# Altium schematic sheet Main Schematics.SchDoc (part 2 of 3)
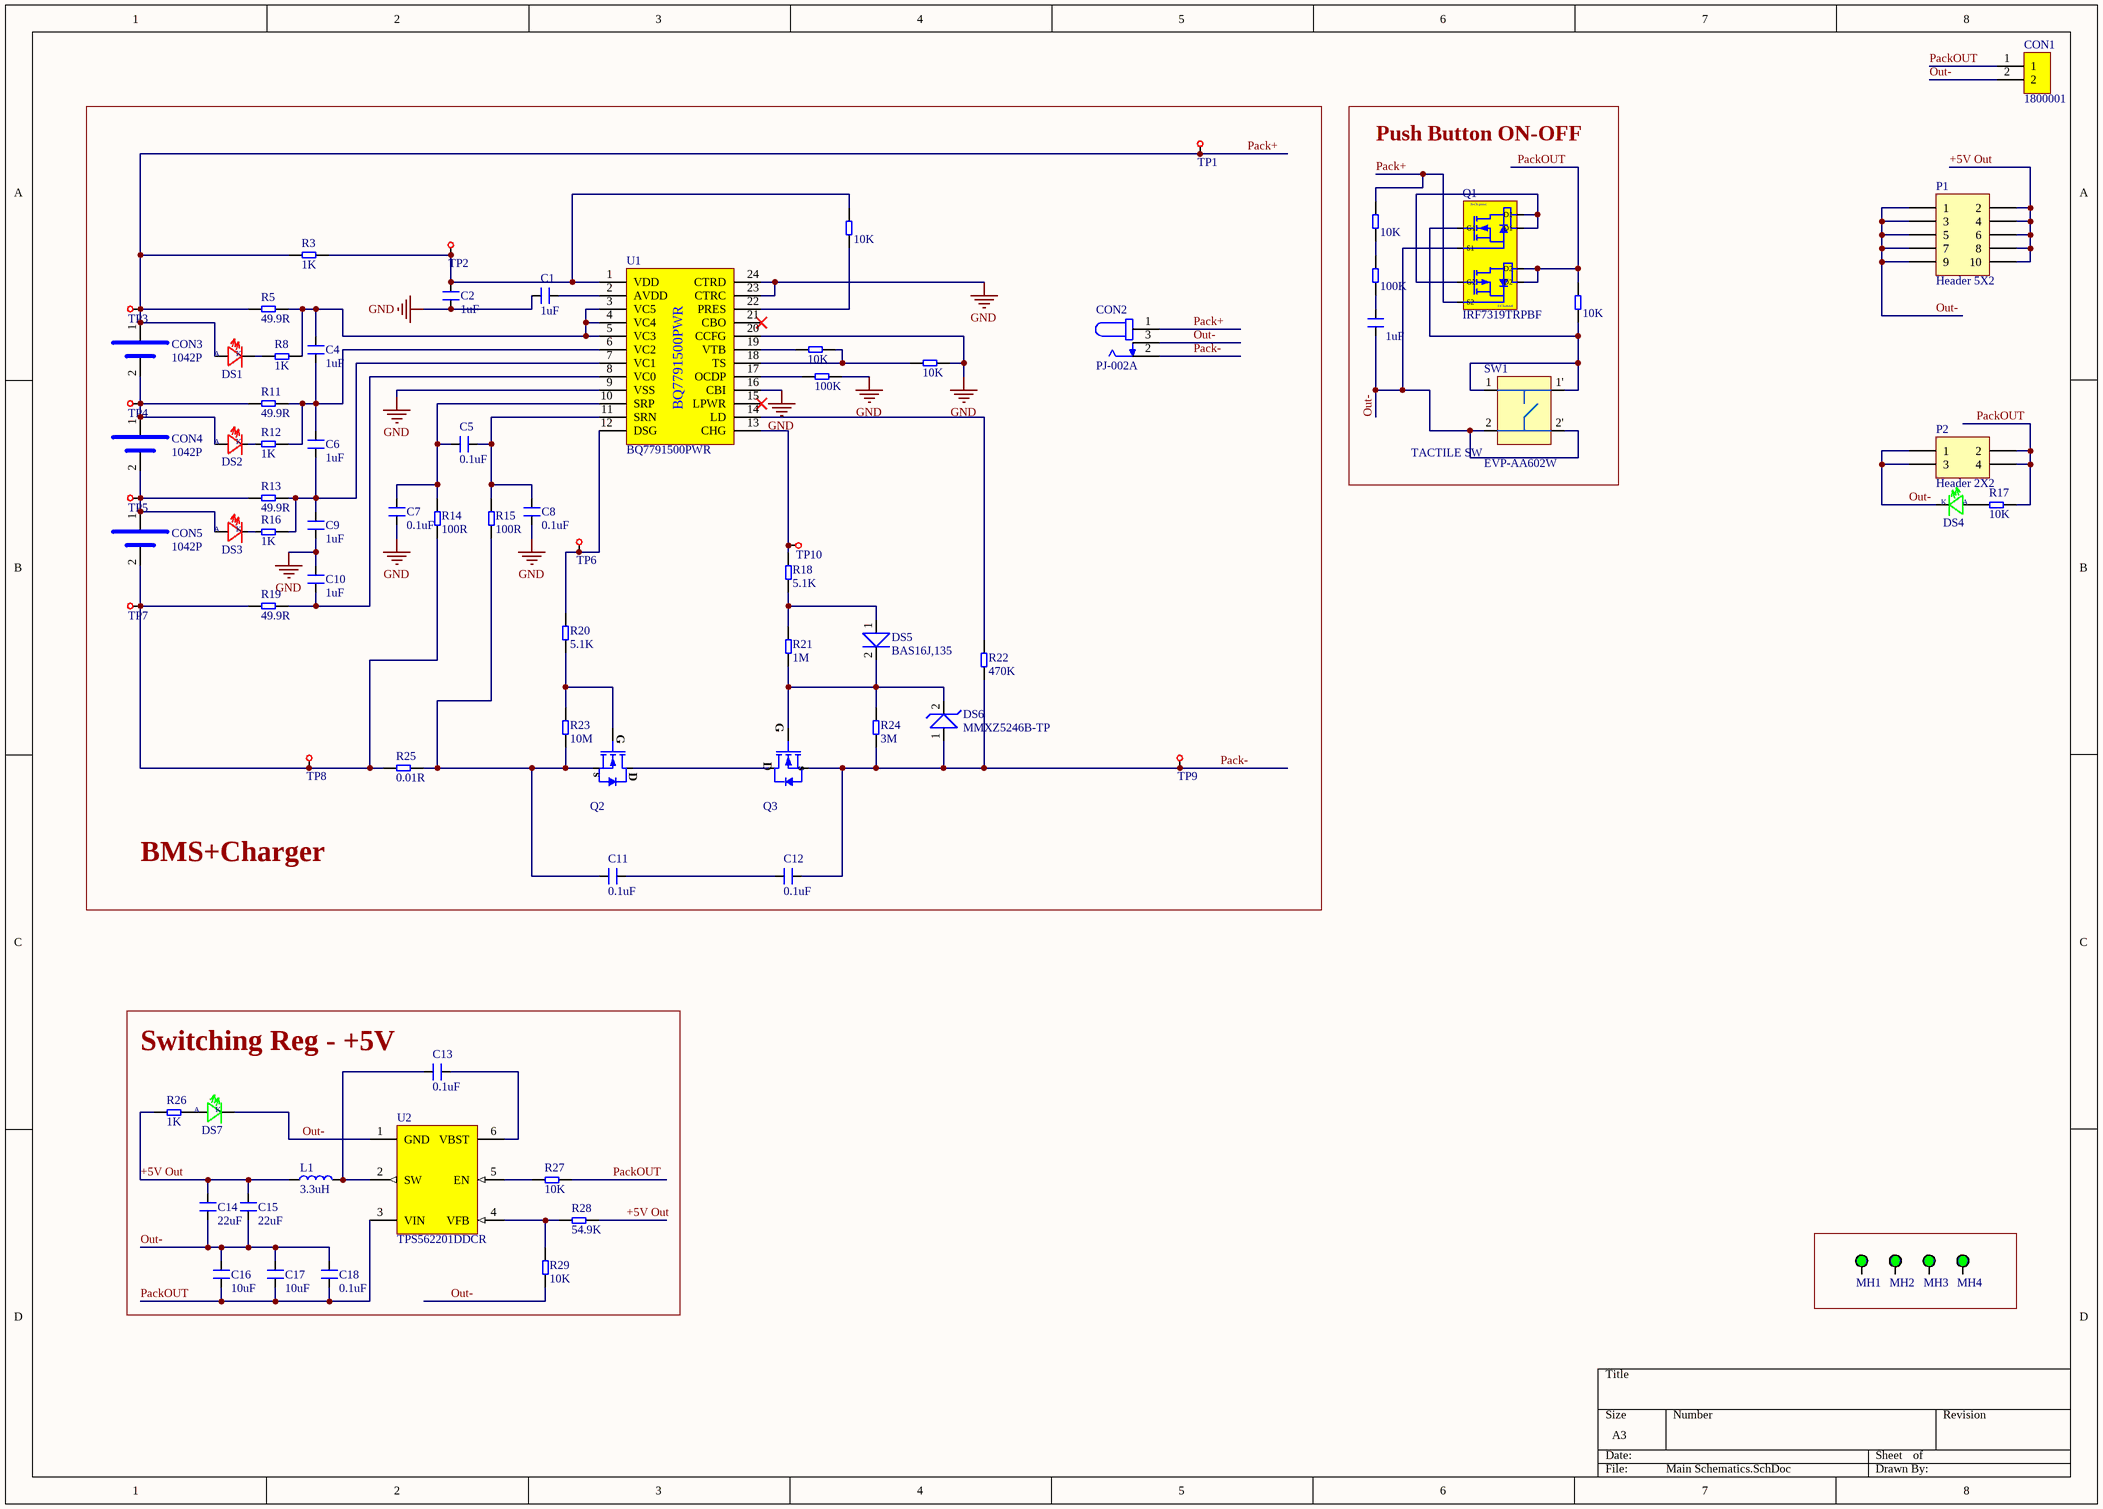
[diagram p1: Main Schematics.SchDoc]
## Library data of the parts
C1 C2 C4 C6 C9 C10 = CAP_1uF_16V_20%_0805: Cap, 1UF, 16V, Mlcc, 0805;; Manufacturer: KEMET; Manufacturer Part Number: C0805C105Z4VAC7210; Tolerance: 80%; Supplier 1: Mouser; RoHS: Yes; Category: Ceramic Capacitors; Stock 1: 28110; Pricing 1: 1=0.12, 10=0.079, 50=0.079, 100=0.037, 1000=0.022, 10000=0.017 (USD); Mount: Surface Mount; Case/Package: 0805; Min Operating Temperature: -30°C; Max Operating Temperature: 85°C; Series: SMD Comm Y5V; Voltage Rating: 16V; Capacitance: 1uF; RoHS Compliant: Yes; Supplier 2: Digi-Key; Manufacturer 2: KEMET; Manufacturer Part Number 2: C0805C105Z4VAC7210; Stock 2: 109336; Pricing 2: 1=0.1, 10=0.075, 50=0.0424, 100=0.0351, 500=0.0246, 1000=0.02036, 2500=0.01895, 5000=0.01734 (USD); Supplier 3: Mouser; Manufacturer 3: KEMET; Manufacturer Part Number 3: C0805C105Z4VAC7210; Stock 3: 14106; Pricing 3: 1=0.12, 10=0.079, 50=0.079, 100=0.037, 1000=0.022, 10000=0.016 (USD)
C3 = CAP_1uF_50V_10%_0805: Multilayer Ceramic Capacitor, 1 uF, 50 V, ± 10%, X7R, 0805 [2012 Metric]; Manufacturer: KEMET; Manufacturer Part Number: C0805C105K5RACTU; Voltage Rating: 50V; Supplier 1: Mouser; RoHS: Yes; Category: Ceramic Capacitors; Stock 1: 246479; Pricing 1: 1=0.33, 10=0.171, 50=0.171, 100=0.11, 1000=0.092, 10000=0.076 (USD); Mount: Surface Mount,PCB; Case/Package: 0805; Case Code (Metric): 2012; Case Code (Imperial): 0805; Dielectric Material: Ceramic; Min Operating Temperature: -55°C; Max Operating Temperature: 125°C; Packaging: Tape and Reel; Capacitance: 1uF; Tolerance: 10%; Voltage Rating (DC): 50V; Package Quantity: 1; Dielectric: X7R; Termination: SMD/SMT; Voltage: 50V; Series: C; Construction: Flat; Length: 2mm; Width: 0.049inch; Height: 1.25mm; Thickness: 0.055inch; Depth: 1.25mm; Reach SVHC Compliant: No; RoHS Compliant: Yes; ComponentLink1URL: https://datasheet.ciiva.com/7842/1732744-7842192.pdf?src-supplier=Element14; ComponentLink1Description: https://datasheet.ciiva.com/7842/1732744-7842192.pdf?src-supplier=Element14; ComponentLink2URL: https://datasheet.ciiva.com/22700/1851736-22700523.pdf?src-supplier=Element14; ComponentLink2Description: https://datasheet.ciiva.com/22700/1851736-22700523.pdf?src-supplier=Element14; ComponentLink3URL: https://datasheet.ciiva.com/5408/kem-c1002-x7r-smd-5408569.pdf?src-supplier=Mouser; ComponentLink3Description: https://datasheet.ciiva.com/5408/kem-c1002-x7r-smd-5408569.pdf?src-supplier=Mouser; Supplier 2: Digi-Key; Manufacturer 2: KEMET; Manufacturer Part Number 2: C0805C105K5RACTU; Stock 2: 167514; Pricing 2: 1=0.33, 10=0.231, 50=0.162, 100=0.1388, 500=0.10412, 1000=0.08792 (USD)
C5 C7 C8 C11 C12 = CAP_0.1uF_16V_10%_0805: Multilayer Ceramic Capacitor, 0.1 uF, 16 V, ± 10%, X7R, 0805 [2012 Metric]; Manufacturer: KEMET; Manufacturer Part Number: C0805C104K4RACTU; Capacitance: 100nF; Voltage Rating: 16V; Supplier 1: Mouser; RoHS: Yes; Category: Ceramic Capacitors; Stock 1: 90803; Pricing 1: 1=0.15, 10=0.078, 50=0.078, 100=0.044, 1000=0.03, 10000=0.023 (USD); Mount: Surface Mount,PCB; Case/Package: 0805; Number of Pins: 2; Case Code (Imperial): 0805; Case Code (Metric): 2012; Contact Plating: Tin,Matte; Dielectric Material: Ceramic; Min Operating Temperature: -55°C; Max Operating Temperature: 125°C; Packaging: Tape and Reel; Package Quantity: 4000; Tolerance: 10%; Voltage Rating (DC): 16V; Dielectric: X7R; Termination: SMD/SMT; Voltage: 16V; Series: SMD Comm X7R; Construction: Flat; Length: 2mm; Height: 0.9mm; Lead Pitch: 0.75mm; Depth: 1.25mm; Radiation Hardening: No; Reach SVHC Compliant: No; RoHS Compliant: Yes; ComponentLink1URL: https://datasheet.ciiva.com/46443/1851736-46443711.pdf?src-supplier=Element14; ComponentLink1Description: https://datasheet.ciiva.com/46443/1851736-46443711.pdf?src-supplier=Element14; ComponentLink2URL: https://datasheet.ciiva.com/46443/1851736-46443710.pdf?src-supplier=Element14; ComponentLink2Description: https://datasheet.ciiva.com/46443/1851736-46443710.pdf?src-supplier=Element14; Supplier 2: Digi-Key; Manufacturer 2: KEMET; Manufacturer Part Number 2: C0805C104K4RACTU; Stock 2: 179111; Pricing 2: 1=0.18, 10=0.13, 50=0.0736, 100=0.061, 500=0.04274, 1000=0.03539 (USD); Supplier 3: Mouser; Manufacturer 3: KEMET; Manufacturer Part Number 3: C0805C104K4RACTU; Stock 3: 60653; Pricing 3: 1=0.17, 10=0.078, 50=0.078, 100=0.045, 1000=0.032, 10000=0.023 (USD); Supplier Part Number 3: 80-C0805C104K4R
C13 C18 = CAP_0.1uF_50V_10%_0805: SMD Comm X7R 0805 (2012Metric) Ceramic Capacitor 0.079Lx0.049W 2.00mmx1.25mm X7R ±10% 0.1muF; Manufacturer: KEMET; Manufacturer Part Number: C0805C104K5RAC7210; Capacitance: 100nF; Voltage Rating: 50V; Supplier 1: Mouser; RoHS: Yes; Category: Ceramic Capacitors; Stock 1: 173866; Pricing 1: 1=0.13, 10=0.055, 50=0.055, 100=0.032, 1000=0.024, 10000=0.024 (USD); Mount: Surface Mount; Case/Package: 0805; Case Code (Metric): 2012; Case Code (Imperial): 0805; Dielectric Material: Ceramic; Min Operating Temperature: -55°C; Max Operating Temperature: 125°C; Tolerance: 10%; Dielectric: X7R; Packaging: Tape and Reel; Package Quantity: 15000; Voltage Rating (DC): 50V; Termination: SMD/SMT; Series: C; Construction: Flat; Length: 2mm; Width: 0.049inch; Height: 0.9mm; Depth: 1.25mm; Lead Pitch: 0.75mm; Thickness: 0.035inch; Radiation Hardening: No; RoHS Compliant: Yes; ComponentLink1URL: http://www.farnell.com/datasheets/2750461.pdf?src-supplier=Farnell; ComponentLink1Description: http://www.farnell.com/datasheets/2750461.pdf?src-supplier=Farnell; ComponentLink2URL: http://www.mouser.com/ds/2/212/KEM_C1002_X7R_SMD-1102033.pdf?src-supplier=Mouser; ComponentLink2Description: http://www.mouser.com/ds/2/212/KEM_C1002_X7R_SMD-1102033.pdf?src-supplier=Mouser; ComponentLink3URL: http://components.arrow.com/part/dataview/1379060S8109168N7429?src-supplier=Arrow+Electronics; ComponentLink3Description: http://components.arrow.com/part/dataview/1379060S8109168N7429?src-supplier=Arrow+Electronics; ComponentLink4URL: http://capacitoredge.kemet.com/capedge2/DataSheet/Datasheet-C0805C104K5RAC7210.pdf?pn=C0805C104K5RAC7210&src-supplier=Avnet; ComponentLink4Description: http://capacitoredge.kemet.com/capedge2/DataSheet/Datasheet-C0805C104K5RAC7210.pdf?pn=C0805C104K5RAC7210&src-supplier=Avnet; ComponentLink5URL: http://www.farnell.com/datasheets/2750461.pdf?src-supplier=Newark; ComponentLink5Description: http://www.farnell.com/datasheets/2750461.pdf?src-supplier=Newark; ComponentLink6URL: http://www.farnell.com/datasheets/2750461.pdf?src-supplier=Element14; ComponentLink6Description: http://www.farnell.com/datasheets/2750461.pdf?src-supplier=Element14; ComponentLink7URL: https://api.kemet.com/component-edge/download/datasheet/C0805C104K5RAC7210.pdf?src-supplier=Digi-Key; ComponentLink7Description: https://api.kemet.com/component-edge/download/datasheet/C0805C104K5RAC7210.pdf?src-supplier=Digi-Key; ComponentLink8URL: https://www.verical.com/server-webapp/html/getDatasheet?partID=114317&src-supplier=Verical; ComponentLink8Description: https://www.verical.com/server-webapp/html/getDatasheet?partID=114317&src-supplier=Verical; ComponentLink9URL: http://www.kemet.com/kemet/web/homepage/kechome.nsf/weben/C4DA2DA1D1C9D3C3CA2570A50016092D/$file/KEM_C1002_X7R_SMD.pdf; ComponentLink9Description: http://www.kemet.com/kemet/web/homepage/kechome.nsf/weben/C4DA2DA1D1C9D3C3CA2570A50016092D/$file/KEM_C1002_X7R_SMD.pdf; ComponentLink10URL: https://datasheet.octopart.com/C0805C104K5RAC7210-KEMET-datasheet-130259742.pdf?src-supplier=TME; ComponentLink10Description: https://datasheet.octopart.com/C0805C104K5RAC7210-KEMET-datasheet-130259742.pdf?src-supplier=TME; ComponentLink11URL: https://datasheet.octopart.com/C0805C104K5RAC7210-KEMET-datasheet-37550250.pdf?src-supplier=Electro+Sonic; ComponentLink11Description: https://datasheet.octopart.com/C0805C104K5RAC7210-KEMET-datasheet-37550250.pdf?src-supplier=Electro+Sonic; Supplier 2: Digi-Key; Manufacturer 2: KEMET; Manufacturer Part Number 2: C0805C104K5RAC7210; Stock 2: 1684433; Pricing 2: 1=0.13, 10=0.092, 50=0.052, 100=0.0431, 500=0.03022, 1000=0.02502, 2500=0.02328, 5000=0.0213 (USD); Supplier 3: Mouser; Manufacturer 3: KEMET; Manufacturer Part Number 3: C0805C104K5RAC7210; Stock 3: 170881; Pricing 3: 1=0.13, 10=0.055, 50=0.055, 100=0.032, 1000=0.024, 10000=0.018 (USD); Supplier Part Number 3: 80-C0805C104K5R7210
C14 C15 = CAP_22uF-25V-20%-0805: 0805 25 V 22 uF ±20% Tolerance X5R Monolithic Ceramic Chip Capacitor; Manufacturer: Murata Electronics; Manufacturer Part Number: GRM21BR61E226ME44K; Manufacturer 1: Murata; Voltage Rating: 25V; Case/Package: 0805; Supplier-1: Digikey; Supplier 1: Digi-Key; Manufacturer Part Number 1: GRM21BR61E226ME44K; RoHS: Yes; Category: Ceramic Capacitors; Stock 1: 809289; Pricing 1: 1=0.3, 10=0.205, 50=0.1436, 100=0.1231, 500=0.09234, 1000=0.07798, 2500=0.07387, 5000=0.06977 (USD); Mount: Surface Mount; Case Code (Imperial): 0805; Case Code (Metric): 2012; Weight: 0.000335oz; Min Operating Temperature: -55°C; Max Operating Temperature: 85°C; Packaging: Tape and Reel; Capacitance: 22uF; Tolerance: 20%; Dielectric: X5R; Termination: SMD/SMT; Voltage Rating (DC): 25V; Package Quantity: 10000; Series: GRM; Length: 0.079inch; Width: 1.25mm; Height: 1.25mm; Thickness: 0.057inch; RoHS Compliant: Yes; ComponentLink1URL: http://www.mouser.com/ds/2/281/c02e-2905.pdf?src-supplier=Mouser; ComponentLink1Description: http://www.mouser.com/ds/2/281/c02e-2905.pdf?src-supplier=Mouser; ComponentLink2URL: http://search.murata.co.jp/Ceramy/image/img/A01X/G101/ENG/GRM21BR61E226ME44-01.pdf?src-supplier=Digi-Key; ComponentLink2Description: http://search.murata.co.jp/Ceramy/image/img/A01X/G101/ENG/GRM21BR61E226ME44-01.pdf?src-supplier=Digi-Key; ComponentLink3URL: https://search.murata.co.jp/Ceramy/image/img/A01X/G101/ENG/GRM21BR61E226ME44-01.pdf?src-supplier=Digi-Key; ComponentLink3Description: https://search.murata.co.jp/Ceramy/image/img/A01X/G101/ENG/GRM21BR61E226ME44-01.pdf?src-supplier=Digi-Key; Supplier Part Number 1: 490-14661-1-ND
C16 C17 = CAP_10uF_25V_10%_1206: Multilayer Ceramic Capacitor, 10 uF, 25 V, ± 10%, X5R, 1206 [3216 Metric]; Manufacturer 1: KEMET; Manufacturer Part Number 1: C1206C106K3PACTU; Material: 4241ConductorMaterial; Voltage Rating (DC): 25V; Dissipation Factor: 5%; Supplier 1: Digi-Key; RoHS: Yes; Category: Ceramic Capacitors; Stock 1: 101746; Pricing 1: 1=0.35, 10=0.243, 50=0.17, 100=0.1457, 500=0.1093, 1000=0.09229 (USD); Mount: Surface Mount; Case/Package: 1206; Number of Pins: 2NUMBER; Case Code (Imperial): 1206; Case Code (Metric): 3216; Contact Plating: 154ConductorMaterial; Min Operating Temperature: -55°C; Max Operating Temperature: 85°C; Capacitance: 10uF; Tolerance: 10%; Dielectric: X5R; Packaging: Tape and Reel; Voltage Rating: 25V; Series: SMD Comm X5R; Voltage Rating (AC): 25V; Length: 3.2mm; Width: 1.6002mm; Thickness: 1.8034mm; Depth: 1.6mm; Radiation Hardening: No; Reach SVHC Compliant: 4186SVHC; Lead Free: 5697LeadFree; RoHS Compliant: Yes; ComponentLink1URL: http://www.farnell.com/datasheets/2739687.pdf?src-supplier=Farnell; ComponentLink1Description: http://www.farnell.com/datasheets/2739687.pdf?src-supplier=Farnell; ComponentLink2URL: https://www.verical.com/server-webapp/html/getDatasheet?partID=385834&src-supplier=Verical; ComponentLink2Description: https://www.verical.com/server-webapp/html/getDatasheet?partID=385834&src-supplier=Verical; ComponentLink3URL: http://www.onlinecomponents.com/productFiles/mf-KEM/kem_c1006_x5r_smd.pdf?src-supplier=Onlinecomponents.com; ComponentLink3Description: http://www.onlinecomponents.com/productFiles/mf-KEM/kem_c1006_x5r_smd.pdf?src-supplier=Onlinecomponents.com; ComponentLink4URL: http://datasheet.octopart.com/C1206C106K3PAC-TU-Kemet-datasheet-5314969.pdf?src-supplier=Onlinecomponents.com; ComponentLink4Description: http://datasheet.octopart.com/C1206C106K3PAC-TU-Kemet-datasheet-5314969.pdf?src-supplier=Onlinecomponents.com; ComponentLink5URL: http://www.farnell.com/datasheets/2739687.pdf?src-supplier=Newark; ComponentLink5Description: http://www.farnell.com/datasheets/2739687.pdf?src-supplier=Newark; ComponentLink6URL: https://api.kemet.com/component-edge/download/datasheet/C1206C106K3PACTU.pdf?src-supplier=Digi-Key; ComponentLink6Description: https://api.kemet.com/component-edge/download/datasheet/C1206C106K3PACTU.pdf?src-supplier=Digi-Key; ComponentLink7URL: http://datasheet.octopart.com/C1206C106K3PAC-TU-Kemet-datasheet-5314969.pdf?src-supplier=Mouser; ComponentLink7Description: http://datasheet.octopart.com/C1206C106K3PAC-TU-Kemet-datasheet-5314969.pdf?src-supplier=Mouser; ComponentLink8URL: http://datasheet.octopart.com/C1206C106K3PAC-TU-Kemet-datasheet-5314969.pdf?src-supplier=Digi-Key; ComponentLink8Description: http://datasheet.octopart.com/C1206C106K3PAC-TU-Kemet-datasheet-5314969.pdf?src-supplier=Digi-Key; ComponentLink9URL: http://datasheet.octopart.com/C1206C106K3PAC-TU-Kemet-datasheet-5314969.pdf?src-supplier=Verical; ComponentLink9Description: http://datasheet.octopart.com/C1206C106K3PAC-TU-Kemet-datasheet-5314969.pdf?src-supplier=Verical; ComponentLink10URL: http://datasheet.octopart.com/C1206C106K3PAC-TU-Kemet-datasheet-5314969.pdf?src-supplier=Avnet; ComponentLink10Description: http://datasheet.octopart.com/C1206C106K3PAC-TU-Kemet-datasheet-5314969.pdf?src-supplier=Avnet; ComponentLink11URL: https://datasheet.octopart.com/C1206C106K3PACTU-Kemet-datasheet-10978831.pdf?src-supplier=Newark; ComponentLink11Description: https://datasheet.octopart.com/C1206C106K3PACTU-Kemet-datasheet-10978831.pdf?src-supplier=Newark; ComponentLink12URL: http://datasheet.octopart.com/C1206C106K3PAC-TU-Kemet-datasheet-5314969.pdf?src-supplier=Distrelec; ComponentLink12Description: http://datasheet.octopart.com/C1206C106K3PAC-TU-Kemet-datasheet-5314969.pdf?src-supplier=Distrelec; ComponentLink13URL: http://www.farnell.com/datasheets/2739687.pdf?src-supplier=Element14; ComponentLink13Description: http://www.farnell.com/datasheets/2739687.pdf?src-supplier=Element14; ComponentLink14URL: https://datasheet.octopart.com/C1206C106K3PACTU-Kemet-datasheet-22084244.pdf?src-supplier=Element14; ComponentLink14Description: https://datasheet.octopart.com/C1206C106K3PACTU-Kemet-datasheet-22084244.pdf?src-supplier=Element14; ComponentLink15URL: http://datasheet.octopart.com/C1206C106K3PAC-TU-Kemet-datasheet-5314969.pdf?src-supplier=Rs; ComponentLink15Description: http://datasheet.octopart.com/C1206C106K3PAC-TU-Kemet-datasheet-5314969.pdf?src-supplier=Rs; ComponentLink16URL: http://datasheet.octopart.com/C1206C106K3PAC-TU-Kemet-datasheet-5314969.pdf?src-supplier=LCSC; ComponentLink16Description: http://datasheet.octopart.com/C1206C106K3PAC-TU-Kemet-datasheet-5314969.pdf?src-supplier=LCSC; ComponentLink17URL: https://datasheet.octopart.com/C1206C106K3PAC7800-KEMET-datasheet-165611373.pdf?src-supplier=TME; ComponentLink17Description: https://datasheet.octopart.com/C1206C106K3PAC7800-KEMET-datasheet-165611373.pdf?src-supplier=TME; ComponentLink18URL: http://datasheet.octopart.com/C1206C106K3PAC-TU-Kemet-datasheet-5314969.pdf?src-supplier=NAC+Semi; ComponentLink18Description: http://datasheet.octopart.com/C1206C106K3PAC-TU-Kemet-datasheet-5314969.pdf?src-supplier=NAC+Semi; ComponentLink19URL: http://datasheet.octopart.com/C1206C106K3PAC-TU-Kemet-datasheet-5314969.pdf?src-supplier=Quest; ComponentLink19Description: http://datasheet.octopart.com/C1206C106K3PAC-TU-Kemet-datasheet-5314969.pdf?src-supplier=Quest; ComponentLink20URL: http://datasheet.octopart.com/C1206C106K3PAC-TU-Kemet-datasheet-5314969.pdf?src-supplier=TTI; ComponentLink20Description: http://datasheet.octopart.com/C1206C106K3PAC-TU-Kemet-datasheet-5314969.pdf?src-supplier=TTI; ComponentLink21URL: https://datasheet.octopart.com/C1206C106K3PACTU-KEMET-datasheet-134136060.pdf?src-supplier=Electro+Sonic; ComponentLink21Description: https://datasheet.octopart.com/C1206C106K3PACTU-KEMET-datasheet-134136060.pdf?src-supplier=Electro+Sonic; Supplier Part Number 1: 399-C1206C106K3PAC7800DKR-ND
CON1 = CON_ED_2-pos_2.54mm_Phoenix Contact: PCB Terminal Screw 2.54mm 20AWG 160V 6A 2 Position Combicon Control Series; Supplier 1: Digi-Key; Manufacturer 1: Phoenix Contact; Manufacturer Part Number 1: 1800001; RoHS: Yes; Category: Terminal Blocks; Stock 1: 169; Pricing 1: 1=1.45, 10=1.408, 50=1.3156, 100=1.2104, 250=1.11828, 500=1.1154 (USD); ComponentLink1URL: http://www.mouser.com/ds/2/324/ItemDetail_1800001-929782.pdf?src-supplier=Mouser; ComponentLink1Description: http://www.mouser.com/ds/2/324/ItemDetail_1800001-929782.pdf?src-supplier=Mouser; ComponentLink2URL: http://components.arrow.com/part/dataview/46117015S71155N1555?src-supplier=Arrow+Electronics; ComponentLink2Description: http://components.arrow.com/part/dataview/46117015S71155N1555?src-supplier=Arrow+Electronics; ComponentLink3URL: https://media.digikey.com/pdf/Data%20Sheets/Phoenix%20Contact%20PDFs/1800001.pdf?src-supplier=Digi-Key; ComponentLink3Description: https://media.digikey.com/pdf/Data%20Sheets/Phoenix%20Contact%20PDFs/1800001.pdf?src-supplier=Digi-Key; Supplier Part Number 1: 277-17216-ND
CON2 = CON_ED_DC-JACK_RA_PJ-002A: 2.0 x 6.5 mm, 2.5 A, Horizontal, Through Hole, Dc Power Jack Connector; Manufacturer 1: CUI Devices; Supplier 1: Digi-Key; Manufacturer Part Number 1: PJ-002A; RoHS: Yes; Category: Power Connectors; Stock 1: 67885; Pricing 1: 1=0.7, 25=0.5692, 100=0.5037, 500=0.43708, 2500=0.33482, 10000=0.31654 (USD); ComponentLink1URL: https://datasheet.octopart.com/PJ-002A-CUI-datasheet-37357.pdf?src-supplier=Digi-Key; ComponentLink1Description: https://datasheet.octopart.com/PJ-002A-CUI-datasheet-37357.pdf?src-supplier=Digi-Key; ComponentLink2URL: https://datasheet.octopart.com/PJ-002A-CUI-Devices-datasheet-137760667.pdf?src-supplier=Future+Electronics; ComponentLink2Description: https://datasheet.octopart.com/PJ-002A-CUI-Devices-datasheet-137760667.pdf?src-supplier=Future+Electronics; ComponentLink3URL: https://datasheet.octopart.com/PJ-002A-CUI-Devices-datasheet-103108261.pdf?src-supplier=Electro+Sonic; ComponentLink3Description: https://datasheet.octopart.com/PJ-002A-CUI-Devices-datasheet-103108261.pdf?src-supplier=Electro+Sonic; ComponentLink4URL: https://datasheet.octopart.com/PJ-002A-CUI-Devices-datasheet-141000101.pdf?src-supplier=Master+Electronics; ComponentLink4Description: https://datasheet.octopart.com/PJ-002A-CUI-Devices-datasheet-141000101.pdf?src-supplier=Master+Electronics; Supplier Part Number 1: CP-002A-ND
CON3-CON5 = CON_18650_BATT: Cylindrical Battery Contacts, Clips, Holders & Springs SMT Polarized Holder for 18650 Battery; Manufacturer 1: Keystone Electronics; Supplier 1: Digi-Key; Manufacturer Part Number 1: 1042P; RoHS: No; Category: Batteries and Accessories; Stock 1: 25811; Pricing 1: 1=5.34, 25=4.4896, 100=3.7118, 250=3.41128, 500=3.19918, 1000=2.98708, 2500=2.70428, 5000=2.1 (USD); ComponentLink1URL: http://www.farnell.com/datasheets/2067690.pdf?src-supplier=Farnell; ComponentLink1Description: http://www.farnell.com/datasheets/2067690.pdf?src-supplier=Farnell; ComponentLink2URL: http://www.mouser.com/ds/2/215/042P-744096.pdf?src-supplier=Mouser; ComponentLink2Description: http://www.mouser.com/ds/2/215/042P-744096.pdf?src-supplier=Mouser; ComponentLink3URL: http://www.farnell.com/datasheets/2067690.pdf?src-supplier=Newark; ComponentLink3Description: http://www.farnell.com/datasheets/2067690.pdf?src-supplier=Newark; ComponentLink4URL: http://keyelco.com/product-pdf.cfm?p=13957&src-supplier=Digi-Key; ComponentLink4Description: http://keyelco.com/product-pdf.cfm?p=13957&src-supplier=Digi-Key; ComponentLink5URL: https://datasheet.octopart.com/1042P-Keystone-datasheet-65568923.pdf?src-supplier=Element14; ComponentLink5Description: https://datasheet.octopart.com/1042P-Keystone-datasheet-65568923.pdf?src-supplier=Element14; ComponentLink6URL: https://datasheet.octopart.com/1042P-Keystone-datasheet-159767845.pdf?src-supplier=TME; ComponentLink6Description: https://datasheet.octopart.com/1042P-Keystone-datasheet-159767845.pdf?src-supplier=TME; Supplier Part Number 1: 36-1042P-ND
DS1-DS3 = LED_Red_0603_2.2V_HSMS-C190: LED Low-Power Uni-Color Red 630nm 2.1V 2-Pin Chip LED T/R; Manufacturer: Broadcom Avago; Supplier 1: Digi-Key; Supplier Part Number 1: 516-1422-1-ND; Manufacturer Part Number: HSMS-C190; RoHS: Yes; Category: LEDs; Stock 1: 190765; Pricing 1: 1=0.41, 10=0.272, 100=0.1813, 500=0.12542, 1000=0.10452, 2000=0.09407 (USD)
DS4 DS7 = LED_Green_0603_2.2V_HSMG-C190: Green 572nm LED Indication - Discrete 2.2V 0603 (1608 Metric); Manufacturer: Broadcom Avago; Supplier 1: Digi-Key; Supplier Part Number 1: 516-1425-1-ND; Manufacturer Part Number: HSMG-C190; RoHS: Yes; Category: LEDs; Stock 1: 262974; Pricing 1: 1=0.39, 10=0.254, 100=0.1696, 500=0.11732, 1000=0.09776, 2000=0.08799 (USD); ComponentLink1URL: https://datasheet.ciiva.com/15117/getdatasheetpartid-110413-15117483.pdf?src-supplier=Verical; ComponentLink1Description: https://datasheet.ciiva.com/15117/getdatasheetpartid-110413-15117483.pdf?src-supplier=Verical; ComponentLink2URL: https://datasheet.ciiva.com/11773/0900766b80ad69c9-11773861.pdf?src-supplier=Rs; ComponentLink2Description: https://datasheet.ciiva.com/11773/0900766b80ad69c9-11773861.pdf?src-supplier=Rs; ComponentLink3URL: https://datasheet.ciiva.com/31395/1487342-31395358.pdf?src-supplier=Farnell; ComponentLink3Description: https://datasheet.ciiva.com/31395/1487342-31395358.pdf?src-supplier=Farnell; ComponentLink4URL: https://datasheet.ciiva.com/29280/180659-da-01-en-chip-led-hsmg-c190-gelb-gruen-29280615.pdf?src-supplier=Conrad; ComponentLink4Description: https://datasheet.ciiva.com/29280/180659-da-01-en-chip-led-hsmg-c190-gelb-gruen-29280615.pdf?src-supplier=Conrad; ComponentLink5URL: https://datasheet.ciiva.com/14172/swseriehsmx-c150toc190-e-14172173.pdf?src-supplier=Distrelec; ComponentLink5Description: https://datasheet.ciiva.com/14172/swseriehsmx-c150toc190-e-14172173.pdf?src-supplier=Distrelec; ComponentLink6URL: https://datasheet.ciiva.com/46426/313031-46426519.pdf?src-supplier=Element14; ComponentLink6Description: https://datasheet.ciiva.com/46426/313031-46426519.pdf?src-supplier=Element14; ComponentLink7URL: https://datasheet.ciiva.com/46426/313031-46426520.pdf?src-supplier=Element14; ComponentLink7Description: https://datasheet.ciiva.com/46426/313031-46426520.pdf?src-supplier=Element14
DS5 = DIO_100V_0.25A_SOD-323F: Rectifier Diode, 1 Phase, 1 Element, 0.25A, 100V V(RRM), Silicon; Manufacturer 1: Nexperia; Average Rectified Current: 250mA; Element Configuration: 5460ElementConfiguration; Forward Voltage: 1.25V; Max Power Dissipation: 550mW; Max Reverse Leakage Current: 30nA; Max Surge Current: 4A; Recovery Time: 4ns; Supplier 1: Digi-Key; Manufacturer Part Number 1: BAS16J,135; RoHS: Yes; Category: Rectifier Diodes; Stock 1: 212933; Pricing 1: 1=0.21, 10=0.19, 100=0.1033, 500=0.06354, 1000=0.04333, 2000=0.03683, 5000=0.03322 (USD); Mount: 8Mount; Number of Pins: 2NUMBER; Min Operating Temperature: -65°C; Max Operating Temperature: 150°C; Forward Current: 250mA; Max Repetitive Reverse Voltage (Vrrm): 100V; Max Reverse Voltage (DC): 100V; Packaging: 10Packaging; Peak Non-Repetitive Surge Current: 4A; Reverse Recovery Time: 4ns; Radiation Hardening: 5898YesNo; RoHS Compliant: Yes; ComponentLink1URL: https://www.mouser.com/ds/2/302/BAS16_SER-471009.pdf?src-supplier=Mouser; ComponentLink1Description: https://www.mouser.com/ds/2/302/BAS16_SER-471009.pdf?src-supplier=Mouser; ComponentLink2URL: https://datasheet.octopart.com/BAS16J%2C135-Nexperia-datasheet-32749520.pdf?src-supplier=Newark; ComponentLink2Description: https://datasheet.octopart.com/BAS16J%2C135-Nexperia-datasheet-32749520.pdf?src-supplier=Newark; ComponentLink3URL: https://datasheet.octopart.com/BAS16J%2C135-Nexperia-datasheet-77871323.pdf?src-supplier=Farnell; ComponentLink3Description: https://datasheet.octopart.com/BAS16J%2C135-Nexperia-datasheet-77871323.pdf?src-supplier=Farnell; ComponentLink4URL: http://www.farnell.com/datasheets/1856332.pdf?src-supplier=Newark; ComponentLink4Description: http://www.farnell.com/datasheets/1856332.pdf?src-supplier=Newark; ComponentLink5URL: https://datasheet.octopart.com/BAS16J%2C135-Nexperia-datasheet-87580831.pdf?src-supplier=Future+Electronics; ComponentLink5Description: https://datasheet.octopart.com/BAS16J%2C135-Nexperia-datasheet-87580831.pdf?src-supplier=Future+Electronics; Supplier Part Number 1: 1727-4797-1-ND
DS6 = DIO-Z_16V_200mW_5%_SOD-323: Diode Zener Single 16V 5% 200mW 2-Pin SOD-323 T/R; Manufacturer 1: MCC; Supplier 1: Digi-Key; Manufacturer Part Number 1: MMXZ5246B-TP; RoHS: Yes; Category: Zener Diodes; Stock 1: 956; Pricing 1: 1=0.21, 10=0.195, 100=0.1062, 500=0.06532, 1000=0.04454 (USD); ComponentLink1URL: https://datasheet.ciiva.com/17380/mmxz5221b-mmxz5259bsod323-17380682.pdf?src-supplier=Future+Electronics; ComponentLink1Description: https://datasheet.ciiva.com/17380/mmxz5221b-mmxz5259bsod323-17380682.pdf?src-supplier=Future+Electronics; ComponentLink2URL: https://datasheet.ciiva.com/18567/mmxz5221b-mmxz5259bsod323-18567734.pdf?src-supplier=Digi-Key; ComponentLink2Description: https://datasheet.ciiva.com/18567/mmxz5221b-mmxz5259bsod323-18567734.pdf?src-supplier=Digi-Key; ComponentLink3URL: https://datasheet.ciiva.com/15060/mmxz5221b-mmxz5259bsod323-15060347.pdf?src-supplier=Digi-Key; ComponentLink3Description: https://datasheet.ciiva.com/15060/mmxz5221b-mmxz5259bsod323-15060347.pdf?src-supplier=Digi-Key; Supplier Part Number 1: 353-MMXZ5246B-TPCT-ND
L1 = IND_3.3uH_6.5A_20%_Non-Std: Power Choke Shielded Wirewound 3.3uH/2.75uH 20% 100KHz 6.5A 17.2mOhm DCR T/R; Manufacturer 1: Wurth Electronics; Manufacturer Part Number 1: 744311330; Self Resonant Frequency: 43MHz; Saturation Current: 11A; DC Resistance (DCR): 17.2mR; Series Resistance: 17.2R; Supplier 1: Digi-Key; RoHS: Yes; Category: Fixed Inductors; Stock 1: 6645; Pricing 1: 1=3.8, 10=3.72, 50=3.44, 100=3.29, 500=3.08 (USD); Mount: Surface Mount; Case/Package: 7040; Number of Pins: 2; Min Operating Temperature: -40°C; Max Operating Temperature: 150°C; Tolerance: 20%; Inductance Tolerance: 20%; Package Quantity: 1; Current Rating: 6.5A; Shielding: Shielded; Packaging: Tape and Reel; Inductance: 3.3uH; Test Frequency: 100kHz; Max DC Current: 6.5A; Termination: SMD/SMT; RMS Current (Irms): 6.5A; Series: WE-HCI; Length: 7mm; Width: 6.9mm; Height: 3.8mm; Height - Seated (Max): 0.157inch; Depth: 6.9mm; Ratings: AEC-Q200; Lead Free: Lead Free; RoHS Compliant: Yes; Reach SVHC Compliant: Unknown; ComponentLink1URL: https://datasheet.ciiva.com/7354/744311330-7354374.pdf?src-supplier=Newark; ComponentLink1Description: https://datasheet.ciiva.com/7354/744311330-7354374.pdf?src-supplier=Newark; ComponentLink2URL: https://datasheet.ciiva.com/4954/744311330-68230-4954765.pdf?src-supplier=Mouser; ComponentLink2Description: https://datasheet.ciiva.com/4954/744311330-68230-4954765.pdf?src-supplier=Mouser; ComponentLink3URL: https://datasheet.ciiva.com/7765/1735740-7765007.pdf?src-supplier=Element14; ComponentLink3Description: https://datasheet.ciiva.com/7765/1735740-7765007.pdf?src-supplier=Element14; ComponentLink4URL: https://datasheet.ciiva.com/11801/0900766b80f886ca-11801820.pdf?src-supplier=Rs; ComponentLink4Description: https://datasheet.ciiva.com/11801/0900766b80f886ca-11801820.pdf?src-supplier=Rs; ComponentLink5URL: https://datasheet.ciiva.com/26307/744311330-eng-tds-26307911.pdf?src-supplier=Distrelec; ComponentLink5Description: https://datasheet.ciiva.com/26307/744311330-eng-tds-26307911.pdf?src-supplier=Distrelec; ComponentLink6URL: https://datasheet.ciiva.com/6690/744311330-6690428.pdf?src-supplier=Digi-Key; ComponentLink6Description: https://datasheet.ciiva.com/6690/744311330-6690428.pdf?src-supplier=Digi-Key; ComponentLink7URL: https://datasheet.ciiva.com/6690/744311330-6690426.pdf?src-supplier=Digi-Key; ComponentLink7Description: https://datasheet.ciiva.com/6690/744311330-6690426.pdf?src-supplier=Digi-Key; ComponentLink8URL: https://datasheet.ciiva.com/6690/744311330-6690431.pdf?src-supplier=Digi-Key; ComponentLink8Description: https://datasheet.ciiva.com/6690/744311330-6690431.pdf?src-supplier=Digi-Key; Supplier Part Number 1: 732-1152-1-ND
MH1-MH4 = MH_3mm: Mounting Hole 3mm
P1 = Header 5X2: Header, 5-Pin, Dual row; LatestRevisionDate: 17-Jul-2002; LatestRevisionNote: Re-released for DXP Platform.; Publisher: Altium Limited
P2 = Header 2X2: Header, 2-Pin, Dual row; LatestRevisionDate: 17-Jul-2002; LatestRevisionNote: Re-released for DXP Platform.; Publisher: Altium Limited
Q1 = MOSFET-Dual_P/N-30V: IRF7319PBF Dual N/P-channel MOSFET Transistor, 4.9 A, 6.5 A, 30 V, 8-Pin SOIC | Infineon IRF7319PBF; Supplier 1: Digi-Key; Manufacturer 1: Infineon; Manufacturer Part Number 1: IRF7319TRPBF; RoHS: Yes; Category: MOSFETs; Stock 1: 22889; Pricing 1: 1=1.19, 10=0.975, 100=0.7584, 500=0.64284, 1000=0.52366, 2000=0.49297 (USD); ComponentLink1URL: http://www.farnell.com/datasheets/137692.pdf?src-supplier=Farnell; ComponentLink1Description: http://www.farnell.com/datasheets/137692.pdf?src-supplier=Farnell; ComponentLink2URL: http://datasheet.octopart.com/IRF7319TRPBF-Infineon-datasheet-70845.pdf?src-supplier=Farnell; ComponentLink2Description: http://datasheet.octopart.com/IRF7319TRPBF-Infineon-datasheet-70845.pdf?src-supplier=Farnell; ComponentLink3URL: http://datasheet.octopart.com/IRF7319TRPBF-Infineon-datasheet-70845.pdf?src-supplier=Avnet; ComponentLink3Description: http://datasheet.octopart.com/IRF7319TRPBF-Infineon-datasheet-70845.pdf?src-supplier=Avnet; ComponentLink4URL: http://www.farnell.com/datasheets/137692.pdf?src-supplier=Element14; ComponentLink4Description: http://www.farnell.com/datasheets/137692.pdf?src-supplier=Element14; ComponentLink5URL: http://datasheet.octopart.com/IRF7319TRPBF-Infineon-datasheet-70845.pdf?src-supplier=Digi-Key; ComponentLink5Description: http://datasheet.octopart.com/IRF7319TRPBF-Infineon-datasheet-70845.pdf?src-supplier=Digi-Key; ComponentLink6URL: https://www.infineon.com/dgdl/irf7319pbf.pdf?fileId=5546d462533600a4015355f5c82f1b41&src-supplier=Digi-Key; ComponentLink6Description: https://www.infineon.com/dgdl/irf7319pbf.pdf?fileId=5546d462533600a4015355f5c82f1b41&src-supplier=Digi-Key; Supplier Part Number 1: IRF7319PBFCT-ND
Q2 Q3 = MOSFET-N_60V-50A_VSONP-8: Trans MOSFET N-CH Si 60V 50A 8-Pin VSONP EP T/R; Manufacturer 1: Texas Instruments; Supplier 1: Digi-Key; Manufacturer Part Number 1: CSD18534Q5A; RoHS: Yes; Category: MOSFETs; Stock 1: 8533; Pricing 1: 1=1.03, 10=0.924, 100=0.7201, 500=0.59488, 1000=0.46965 (USD); ComponentLink1URL: https://datasheet.ciiva.com/6376/csd18534q5a-6376034.pdf?src-supplier=Digi-Key; ComponentLink1Description: https://datasheet.ciiva.com/6376/csd18534q5a-6376034.pdf?src-supplier=Digi-Key; ComponentLink2URL: https://datasheet.ciiva.com/7968/1682185-7968226.pdf?src-supplier=Element14; ComponentLink2Description: https://datasheet.ciiva.com/7968/1682185-7968226.pdf?src-supplier=Element14; ComponentLink3URL: https://datasheet.ciiva.com/14423/csd18534q5a-14423450.pdf?src-supplier=Avnet; ComponentLink3Description: https://datasheet.ciiva.com/14423/csd18534q5a-14423450.pdf?src-supplier=Avnet; ComponentLink4URL: https://datasheet.ciiva.com/14423/csd18534q5a-14423451.pdf?src-supplier=Avnet; ComponentLink4Description: https://datasheet.ciiva.com/14423/csd18534q5a-14423451.pdf?src-supplier=Avnet; Supplier Part Number 1: 296-35583-1-ND
R1 R2 R6 R7 R9 R17 R27 R29 = RES_10K_1/8W_1%_0805: SMD Chip Resistor, 10 kOhm, ± 1%, 125 mW, 0805 [2012 Metric], Thick Film, General Purpose; Manufacturer: Yageo; Manufacturer Part Number: RC0805FR-0710KL; Resistance: 10kR; Temperature Coefficient: 100ppm/°C; Power Rating: 125mW; Voltage Rating: 150V; Supplier 1: Rs; RoHS: Yes; Category: Chip SMD Resistors; Stock 1: 225000; Case/Package: 0805; Case Code (Imperial): 0805; Case Code (Metric): 2012; Size Code: 0805; Min Operating Temperature: -55°C; Max Operating Temperature: 155°C; Packaging: Tape and Reel; Tolerance: 1%; Resistor Type: Thick Film; Package Quantity: 1; Termination: SMD/SMT; Number of Terminations: 2; Max Power Dissipation: 125mW; Features: Moisture Resistant; Series: RC; Construction: Rectangular; Resistance Tolerance: 1%; Technology: THICK FILM; Length: 0.079inch; Width: 0.049inch; Height: 0.024inch; Depth: 1.25mm; Reach SVHC Compliant: Unknown; Lead Free: Lead Free; Military Standard: Not; RoHS Compliant: Yes
R3 R8 R12 R16 R26 = RES_1K_1/8W_1%_0805: SMD Chip Resistor, 1 kOhm, ± 1%, 125 mW, 0805 [2012 Metric], Thick Film, General Purpose; Manufacturer 1: Yageo; Manufacturer Part Number 1: RC0805FR-071KL; Resistance: 1kR; Voltage Rating (DC): 150V; Temperature Coefficient: 100ppm/°C; Power Rating: 125mW; Supplier 1: Digi-Key; RoHS: Yes; Category: Chip SMD Resistors; Stock 1: 5573569; Pricing 1: 1=0.1, 10=0.024, 50=0.0152, 100=0.0127, 500=0.00866, 1000=0.00748 (USD); Case/Package: 0805; Number of Pins: 2; Case Code (Metric): 2012; Case Code (Imperial): 0805; Size Code: 0805; Min Operating Temperature: -55°C; Max Operating Temperature: 155°C; Tolerance: 1%; Packaging: Tape and Reel; Resistor Type: Thick Film; Package Quantity: 1; Voltage Rating: 150V; Termination: SMD/SMT; Series: RC; Number of Terminations: 2; Max Power Dissipation: 125mW; Features: Moisture Resistant; Resistance Tolerance: 1%; Construction: Rectangular; Voltage Rating (AC): 150V; Length: 0.079inch; Width: 0.049inch; Height: 0.024inch; Depth: 1.25mm; Reach SVHC Compliant: No; Lead Free: 5697LeadFree; RoHS Compliant: Yes; Military Standard: Not; ComponentLink1URL: https://datasheet.ciiva.com/7941/1686128-7941719.pdf?src-supplier=Element14; ComponentLink1Description: https://datasheet.ciiva.com/7941/1686128-7941719.pdf?src-supplier=Element14; ComponentLink2URL: https://datasheet.ciiva.com/46385/444164-46385020.pdf?src-supplier=Element14; ComponentLink2Description: https://datasheet.ciiva.com/46385/444164-46385020.pdf?src-supplier=Element14; ComponentLink3URL: https://datasheet.ciiva.com/2456/pyu-r-int-thick-7-2456976.pdf?src-supplier=Digi-Key; ComponentLink3Description: https://datasheet.ciiva.com/2456/pyu-r-int-thick-7-2456976.pdf?src-supplier=Digi-Key; ComponentLink4URL: https://datasheet.ciiva.com/2456/pyu-r-int-thick-7-2456977.pdf?src-supplier=Digi-Key; ComponentLink4Description: https://datasheet.ciiva.com/2456/pyu-r-int-thick-7-2456977.pdf?src-supplier=Digi-Key; ComponentLink5URL: https://datasheet.ciiva.com/2456/pyu-r-int-thick-7-2456975.pdf?src-supplier=Digi-Key; ComponentLink5Description: https://datasheet.ciiva.com/2456/pyu-r-int-thick-7-2456975.pdf?src-supplier=Digi-Key; ComponentLink6URL: https://datasheet.ciiva.com/16850/rc0805-16850409.pdf?src-supplier=Future+Electronics; ComponentLink6Description: https://datasheet.ciiva.com/16850/rc0805-16850409.pdf?src-supplier=Future+Electronics; Supplier Part Number 1: 311-1.00KCRCT-ND
R4 R10 = RES_100K_1/8W_1%_0805: SMD Chip Resistor, 100 kOhm, ± 1%, 125 mW, 0805 [2012 Metric], Thick Film, General Purpose; Manufacturer: Yageo; Manufacturer Part Number: RC0805FR-13100KL; Supplier 1: Future Electronics; RoHS: Yes; Category: Chip SMD Resistors; Stock 1: 3620000; Pricing 1: 20000=0.0021, 80000=0.002, 300000=0.0019, 800000=0.0018, 2000000=0.0017 (USD); ComponentLink1URL: https://datasheet.ciiva.com/5558/rc0805-5558047.pdf?src-supplier=Mouser; ComponentLink1Description: https://datasheet.ciiva.com/5558/rc0805-5558047.pdf?src-supplier=Mouser
R5 R11 R13 R19 = RES_49.9R_1/4W_1%_1206: SMD Chip Resistor, 49.9 Ohm, ± 1%, 250 mW, 1206 [3216 Metric], Thick Film, General Purpose; Manufacturer 1: Yageo; Manufacturer Part Number 1: RC1206FR-0749R9L; Supplier 1: Digi-Key; RoHS: Yes; Category: Chip SMD Resistors; Stock 1: 996807; Pricing 1: 1=0.1, 10=0.036, 50=0.0232, 100=0.0195, 500=0.01364, 1000=0.01187 (USD); ComponentLink1URL: https://datasheet.ciiva.com/11819/0900766b80c6630a-11819940.pdf?src-supplier=Rs; ComponentLink1Description: https://datasheet.ciiva.com/11819/0900766b80c6630a-11819940.pdf?src-supplier=Rs; ComponentLink2URL: https://datasheet.ciiva.com/2557/pyu-rc1206-51-rohs-l-4-2557417.pdf?src-supplier=Digi-Key; ComponentLink2Description: https://datasheet.ciiva.com/2557/pyu-rc1206-51-rohs-l-4-2557417.pdf?src-supplier=Digi-Key; ComponentLink3URL: https://datasheet.ciiva.com/2557/pyu-rc1206-51-rohs-l-4-2557418.pdf?src-supplier=Digi-Key; ComponentLink3Description: https://datasheet.ciiva.com/2557/pyu-rc1206-51-rohs-l-4-2557418.pdf?src-supplier=Digi-Key; ComponentLink4URL: https://datasheet.ciiva.com/2557/pyu-rc1206-51-rohs-l-4-2557419.pdf?src-supplier=Digi-Key; ComponentLink4Description: https://datasheet.ciiva.com/2557/pyu-rc1206-51-rohs-l-4-2557419.pdf?src-supplier=Digi-Key; Supplier Part Number 1: 311-49.9FRCT-ND
R14 R15 = RES_100R_1/8W_1%_0805: SMD Chip Resistor, 100 Ohm, ± 1%, 125 mW, 0805 [2012 Metric], Thick Film, General Purpose; Manufacturer 1: Yageo; Manufacturer Part Number 1: RC0805FR-07100RL; Temperature Coefficient: 100ppm/°C; Power Rating: 125mW; Voltage Rating: 150V; Application(s): HIGH RELIABILITY; Supplier 1: Digi-Key; RoHS: Yes; Category: Chip SMD Resistors; Stock 1: 1802567; Pricing 1: 1=0.1, 10=0.024, 50=0.0152, 100=0.0127, 500=0.00866, 1000=0.00748 (USD); Case Code (Imperial): 0805; Case Code (Metric): 2012; Weight: 0.000917oz; Min Operating Temperature: -55°C; Max Operating Temperature: 155°C; Resistance: 100R; Tolerance: 1%; Packaging: Cut Tape; Package Quantity: 5000; Termination: SMD/SMT; Type: General Purpose; Series: RC; Technology: THICK FILM; Voltage Rating (AC): 150V; Length: 2mm; Width: 1.25mm; Height: 0.5mm; Lead Free: Lead Free; Reach SVHC Compliant: 4187SVHC; RoHS Compliant: Yes; ComponentLink1URL: https://datasheet.ciiva.com/11808/0900766b8106beab-11808877.pdf?src-supplier=Rs; ComponentLink1Description: https://datasheet.ciiva.com/11808/0900766b8106beab-11808877.pdf?src-supplier=Rs; ComponentLink2URL: https://datasheet.ciiva.com/7941/1697719-7941680.pdf?src-supplier=Element14; ComponentLink2Description: https://datasheet.ciiva.com/7941/1697719-7941680.pdf?src-supplier=Element14; ComponentLink3URL: https://datasheet.ciiva.com/7941/1686128-7941679.pdf?src-supplier=Element14; ComponentLink3Description: https://datasheet.ciiva.com/7941/1686128-7941679.pdf?src-supplier=Element14; ComponentLink4URL: https://datasheet.ciiva.com/7660/38627-7660797.pdf?src-supplier=Element14; ComponentLink4Description: https://datasheet.ciiva.com/7660/38627-7660797.pdf?src-supplier=Element14; ComponentLink5URL: https://datasheet.ciiva.com/22747/444164-22747535.pdf?src-supplier=Element14; ComponentLink5Description: https://datasheet.ciiva.com/22747/444164-22747535.pdf?src-supplier=Element14; ComponentLink6URL: https://datasheet.ciiva.com/46447/444164-46447562.pdf?src-supplier=Element14; ComponentLink6Description: https://datasheet.ciiva.com/46447/444164-46447562.pdf?src-supplier=Element14; ComponentLink7URL: https://datasheet.ciiva.com/2456/pyu-r-int-thick-7-2456988.pdf?src-supplier=Digi-Key; ComponentLink7Description: https://datasheet.ciiva.com/2456/pyu-r-int-thick-7-2456988.pdf?src-supplier=Digi-Key; ComponentLink8URL: https://datasheet.ciiva.com/2456/pyu-r-int-thick-7-2456989.pdf?src-supplier=Digi-Key; ComponentLink8Description: https://datasheet.ciiva.com/2456/pyu-r-int-thick-7-2456989.pdf?src-supplier=Digi-Key; ComponentLink9URL: https://datasheet.ciiva.com/2456/pyu-r-int-thick-7-2456987.pdf?src-supplier=Digi-Key; ComponentLink9Description: https://datasheet.ciiva.com/2456/pyu-r-int-thick-7-2456987.pdf?src-supplier=Digi-Key; ComponentLink10URL: https://datasheet.ciiva.com/17082/rc0805-17082697.pdf?src-supplier=Future+Electronics; ComponentLink10Description: https://datasheet.ciiva.com/17082/rc0805-17082697.pdf?src-supplier=Future+Electronics; Supplier Part Number 1: 311-100CRCT-ND
R18 R20 = RES_5.1K_1/8W_1%_0805: SMD Chip Resistor, 5.1 kOhm, ± 1%, 125 mW, 0805 [2012 Metric], Thick Film, General Purpose; Manufacturer 1: Yageo; Manufacturer Part Number 1: RC0805FR-075K1L; Resistance: 5.1kR; Power Rating: 125mW; Voltage Rating: 150V; Temperature Coefficient: 100ppm/°C; Supplier 1: Digi-Key; RoHS: Yes; Category: Chip SMD Resistors; Stock 1: 497934; Pricing 1: 1=0.1, 10=0.024, 50=0.0152, 100=0.0127, 500=0.00866, 1000=0.00748 (USD); Mount: Surface Mount; Case/Package: 0805; Case Code (Metric): 2012; Case Code (Imperial): 0805; Min Operating Temperature: -55°C; Max Operating Temperature: 155°C; Package Quantity: 1; Tolerance: 1%; Packaging: Tape and Reel; Number of Terminations: 2; Termination: SMD/SMT; Max Power Dissipation: 125mW; Voltage Rating (DC): 150V; Features: Moisture Resistant; Series: RC; Technology: THICK FILM; Construction: Rectangular; Length: 0.079inch; Width: 0.049inch; Height: 0.024inch; Depth: 1.25mm; Military Standard: Not; Lead Free: Lead Free; RoHS Compliant: Yes; ComponentLink1URL: https://datasheet.ciiva.com/11808/0900766b8106beab-11808171.pdf?src-supplier=Rs; ComponentLink1Description: https://datasheet.ciiva.com/11808/0900766b8106beab-11808171.pdf?src-supplier=Rs; ComponentLink2URL: https://datasheet.ciiva.com/2456/pyu-r-int-thick-7-2456979.pdf?src-supplier=Digi-Key; ComponentLink2Description: https://datasheet.ciiva.com/2456/pyu-r-int-thick-7-2456979.pdf?src-supplier=Digi-Key; ComponentLink3URL: https://datasheet.ciiva.com/2456/pyu-r-int-thick-7-2456980.pdf?src-supplier=Digi-Key; ComponentLink3Description: https://datasheet.ciiva.com/2456/pyu-r-int-thick-7-2456980.pdf?src-supplier=Digi-Key; ComponentLink4URL: https://datasheet.ciiva.com/2456/pyu-r-int-thick-7-2456978.pdf?src-supplier=Digi-Key; ComponentLink4Description: https://datasheet.ciiva.com/2456/pyu-r-int-thick-7-2456978.pdf?src-supplier=Digi-Key; ComponentLink5URL: https://datasheet.ciiva.com/5558/rc0805-5558152.pdf?src-supplier=Mouser; ComponentLink5Description: https://datasheet.ciiva.com/5558/rc0805-5558152.pdf?src-supplier=Mouser; Supplier Part Number 1: 311-5.10KCRCT-ND
R21 = RES_1M_1/8W_1%_0805: SMD Chip Resistor, 1 MOhm, ± 1%, 125 mW, 0805 [2012 Metric], Thick Film, General Purpose; Manufacturer 1: Yageo; Manufacturer Part Number 1: RC0805FR-131ML; Supplier 1: Digi-Key; RoHS: Yes; Category: Chip SMD Resistors; Stock 1: 50925; Pricing 1: 1=0.1, 10=0.024, 50=0.0152, 100=0.0127, 500=0.00866, 1000=0.00748, 5000=0.00548, 10000=0.00486 (USD); ComponentLink1URL: https://datasheet.ciiva.com/17332/rc0805-17332618.pdf?src-supplier=Future+Electronics; ComponentLink1Description: https://datasheet.ciiva.com/17332/rc0805-17332618.pdf?src-supplier=Future+Electronics; ComponentLink2URL: https://datasheet.ciiva.com/12560/rc0805-257173-12560472.pdf?src-supplier=Mouser; ComponentLink2Description: https://datasheet.ciiva.com/12560/rc0805-257173-12560472.pdf?src-supplier=Mouser; Supplier Part Number 1: 13-RC0805FR-131MLCT-ND
R22 = RES_470K_1/8W_5%_0805: SMD Chip Resistor, 470 kOhm, ± 5%, 125 mW, 0805 [2012 Metric], Thick Film, General Purpose; Manufacturer 1: Yageo; Manufacturer Part Number 1: RC0805JR-07470KL; Voltage Rating (AC): 150V; Supplier 1: Digi-Key; RoHS: Yes; Category: Chip SMD Resistors; Stock 1: 141801; Pricing 1: 1=0.1, 10=0.022, 50=0.0136, 100=0.0114, 500=0.00778, 1000=0.00671 (USD); ComponentLink1URL: https://datasheet.ciiva.com/7941/442941-7941963.pdf?src-supplier=Element14; ComponentLink1Description: https://datasheet.ciiva.com/7941/442941-7941963.pdf?src-supplier=Element14; ComponentLink2URL: https://datasheet.ciiva.com/7941/442941-7941964.pdf?src-supplier=Element14; ComponentLink2Description: https://datasheet.ciiva.com/7941/442941-7941964.pdf?src-supplier=Element14; ComponentLink3URL: https://datasheet.ciiva.com/16747/rc0805-16747222.pdf?src-supplier=Future+Electronics; ComponentLink3Description: https://datasheet.ciiva.com/16747/rc0805-16747222.pdf?src-supplier=Future+Electronics; ComponentLink4URL: https://datasheet.ciiva.com/15190/getdatasheetpartid-323887-15190053.pdf?src-supplier=Verical; ComponentLink4Description: https://datasheet.ciiva.com/15190/getdatasheetpartid-323887-15190053.pdf?src-supplier=Verical; ComponentLink5URL: https://datasheet.ciiva.com/2456/pyu-r-int-thick-7-2456113.pdf?src-supplier=Digi-Key; ComponentLink5Description: https://datasheet.ciiva.com/2456/pyu-r-int-thick-7-2456113.pdf?src-supplier=Digi-Key; ComponentLink6URL: https://datasheet.ciiva.com/2456/pyu-r-int-thick-7-2456114.pdf?src-supplier=Digi-Key; ComponentLink6Description: https://datasheet.ciiva.com/2456/pyu-r-int-thick-7-2456114.pdf?src-supplier=Digi-Key; ComponentLink7URL: https://datasheet.ciiva.com/2456/pyu-r-int-thick-7-2456115.pdf?src-supplier=Digi-Key; ComponentLink7Description: https://datasheet.ciiva.com/2456/pyu-r-int-thick-7-2456115.pdf?src-supplier=Digi-Key; Supplier Part Number 1: 311-470KARCT-ND
R23 = RES_10M_1/8W_5%_0805: Res Thick Film 0805 10M Ohm 5% 0.125W(1/8W) ±100ppm/°C Pad SMD T/R; Manufacturer 1: Yageo; Manufacturer Part Number 1: RC0805JR-0710ML; Voltage Rating (AC): 150V; Supplier 1: Digi-Key; RoHS: Yes; Category: Chip SMD Resistors; Stock 1: 64611; Pricing 1: 1=0.1, 10=0.022, 50=0.0136, 100=0.0114, 500=0.00778, 1000=0.00671 (USD); ComponentLink1URL: https://datasheet.ciiva.com/12667/rc0805-12667352.pdf?src-supplier=Mouser; ComponentLink1Description: https://datasheet.ciiva.com/12667/rc0805-12667352.pdf?src-supplier=Mouser; ComponentLink2URL: https://datasheet.ciiva.com/2456/pyu-r-int-thick-7-2456140.pdf?src-supplier=Digi-Key; ComponentLink2Description: https://datasheet.ciiva.com/2456/pyu-r-int-thick-7-2456140.pdf?src-supplier=Digi-Key; ComponentLink3URL: https://datasheet.ciiva.com/2456/pyu-r-int-thick-7-2456141.pdf?src-supplier=Digi-Key; ComponentLink3Description: https://datasheet.ciiva.com/2456/pyu-r-int-thick-7-2456141.pdf?src-supplier=Digi-Key; ComponentLink4URL: https://datasheet.ciiva.com/2456/pyu-r-int-thick-7-2456142.pdf?src-supplier=Digi-Key; ComponentLink4Description: https://datasheet.ciiva.com/2456/pyu-r-int-thick-7-2456142.pdf?src-supplier=Digi-Key; Supplier Part Number 1: 311-10MARCT-ND
R24 = RES_3M_1/8W_5%_0805: Res Thick Film 0805 3M Ohm 5% 1/8W ±100ppm/°C SMD Paper T/R; Manufacturer 1: Yageo; Manufacturer Part Number 1: RC0805JR-073ML; Supplier 1: Digi-Key; RoHS: Yes; Category: Chip SMD Resistors; Stock 1: 79661; Pricing 1: 1=0.1, 10=0.022, 50=0.0136, 100=0.0114, 500=0.00778, 1000=0.00671 (USD); ComponentLink1URL: https://datasheet.ciiva.com/2491/pyu-r-int-thick-7-2491360.pdf?src-supplier=Digi-Key; ComponentLink1Description: https://datasheet.ciiva.com/2491/pyu-r-int-thick-7-2491360.pdf?src-supplier=Digi-Key; ComponentLink2URL: https://datasheet.ciiva.com/2491/pyu-r-int-thick-7-2491361.pdf?src-supplier=Digi-Key; ComponentLink2Description: https://datasheet.ciiva.com/2491/pyu-r-int-thick-7-2491361.pdf?src-supplier=Digi-Key; ComponentLink3URL: https://datasheet.ciiva.com/2491/pyu-r-int-thick-7-2491362.pdf?src-supplier=Digi-Key; ComponentLink3Description: https://datasheet.ciiva.com/2491/pyu-r-int-thick-7-2491362.pdf?src-supplier=Digi-Key; ComponentLink4URL: https://datasheet.ciiva.com/17422/rc0805-17422951.pdf?src-supplier=Future+Electronics; ComponentLink4Description: https://datasheet.ciiva.com/17422/rc0805-17422951.pdf?src-supplier=Future+Electronics; Supplier Part Number 1: 311-3.0MARCT-ND
R25 = RES_0.01R_1/2W_1%_2010: SMD Current Sense Resistor, 10 Milliohm, ± 1%, 500 mW, 2010 [5025 Metric], Metal Film; Manufacturer 1: Yageo; Manufacturer Part Number 1: PE2010FKE070R01L; Supplier 1: Digi-Key; RoHS: Yes; Category: Chip SMD Resistors; Stock 1: 12447; Pricing 1: 1=0.62, 10=0.458, 25=0.372, 50=0.3236, 100=0.2669, 250=0.23184, 500=0.18872, 1000=0.14968 (USD); ComponentLink1URL: http://www.mouser.com/ds/2/447/PYu-PE_521_RoHS_L_5-1077989.pdf?src-supplier=Mouser; ComponentLink1Description: http://www.mouser.com/ds/2/447/PYu-PE_521_RoHS_L_5-1077989.pdf?src-supplier=Mouser; ComponentLink2URL: http://www.yageo.com/documents/recent/PYu-PE_521_RoHS_L_5.pdf?src-supplier=Digi-Key; ComponentLink2Description: http://www.yageo.com/documents/recent/PYu-PE_521_RoHS_L_5.pdf?src-supplier=Digi-Key; Supplier Part Number 1: 13-PE2010FKE070R01LCT-ND
R28 = RES_54.9K_1/8W_1%_0805: Res Thick Film 0805 54.9K Ohm 1% 1/8W ±100ppm/°C Molded SMD Punched Carrier T/R; Manufacturer 1: Panasonic; Manufacturer Part Number 1: ERJ-6ENF5492V; Supplier 1: Digi-Key; RoHS: Yes; Category: Chip SMD Resistors; Stock 1: 98253; Pricing 1: 1=0.11, 10=0.052, 50=0.0338, 100=0.0287, 500=0.02018, 1000=0.01757 (USD); ComponentLink1URL: https://datasheet.ciiva.com/9188/aoa0000ce2-9188791.pdf?src-supplier=Avnet; ComponentLink1Description: https://datasheet.ciiva.com/9188/aoa0000ce2-9188791.pdf?src-supplier=Avnet; ComponentLink2URL: https://datasheet.ciiva.com/24068/aoa0000ce2-24068921.pdf?src-supplier=Mouser; ComponentLink2Description: https://datasheet.ciiva.com/24068/aoa0000ce2-24068921.pdf?src-supplier=Mouser; ComponentLink3URL: https://datasheet.ciiva.com/46420/1678782-46420313.pdf?src-supplier=Element14; ComponentLink3Description: https://datasheet.ciiva.com/46420/1678782-46420313.pdf?src-supplier=Element14; ComponentLink4URL: https://datasheet.ciiva.com/28563/1694929-28563629.pdf?src-supplier=Element14; ComponentLink4Description: https://datasheet.ciiva.com/28563/1694929-28563629.pdf?src-supplier=Element14; Supplier Part Number 1: P54.9KCDKR-ND